# EAGLE design pihat (EAGLE 9.4.2)
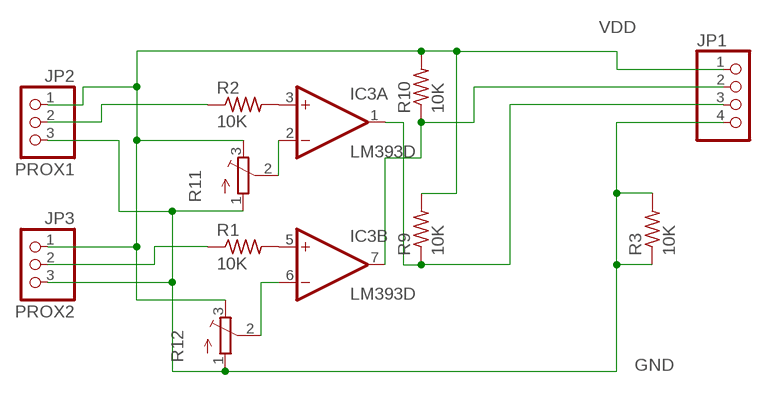
[diagram p0: schematic, sheet 1]

## Parts
IC3  LM393D  [SO08]
JP1  PINHD-1X4  [1X04]
JP2  PROX1  PINHD-1X3  [1X03]
JP3  PROX2  PINHD-1X3  [1X03]
R1  10K  RES-US1206FAB  [R1206FAB]
R2  10K  RES-US1206FAB  [R1206FAB]
R3  10K  RES-US1206FAB  [R1206FAB]
R9  10K  RES-US1206FAB  [R1206FAB]
R10  10K  RES-US1206FAB  [R1206FAB]
R11  TRIM_EU-3223G  [3223G]
R12  TRIM_EU-3223G  [3223G]

## Nets
GND: JP1.4 JP2.3 JP3.3 R3.1 R3.2 R11.1(A) R12.1(A)
N$1: IC3.5(B:+IN) R1.2
N$2: IC3.3(A:+IN) R2.2
N$8: JP2.2 R2.1
N$18: IC3.7(B:OUT) JP1.2 R10.1
N$19: IC3.1(A:OUT) JP1.3 R9.1
N$20: IC3.6(B:-IN) R12.2(S)
N$21: IC3.2(A:-IN) R11.2(S)
N$23: JP3.2 R1.1
VDD: JP1.1 JP2.1 JP3.1 R9.2 R10.2 R11.3(E) R12.3(E)

## Power pins joined to a net without a drawn wire
GND: IC3.4(P:V-)
VDD: IC3.8(P:V+)

## Library data of the parts
IC3 = linear:LM393: COMPARATOR
JP1 = pinhead:PINHD-1X4: PIN HEADER
JP2 JP3 = pinhead:PINHD-1X3: PIN HEADER
R1-R3 R9 R10 = fab:RES-US: Resistor (US Symbol) Variants with postfix FAB are widened to allow the routing of internal traces
R11 R12 = pot:TRIM_EU-: POTENTIOMETER

## Board
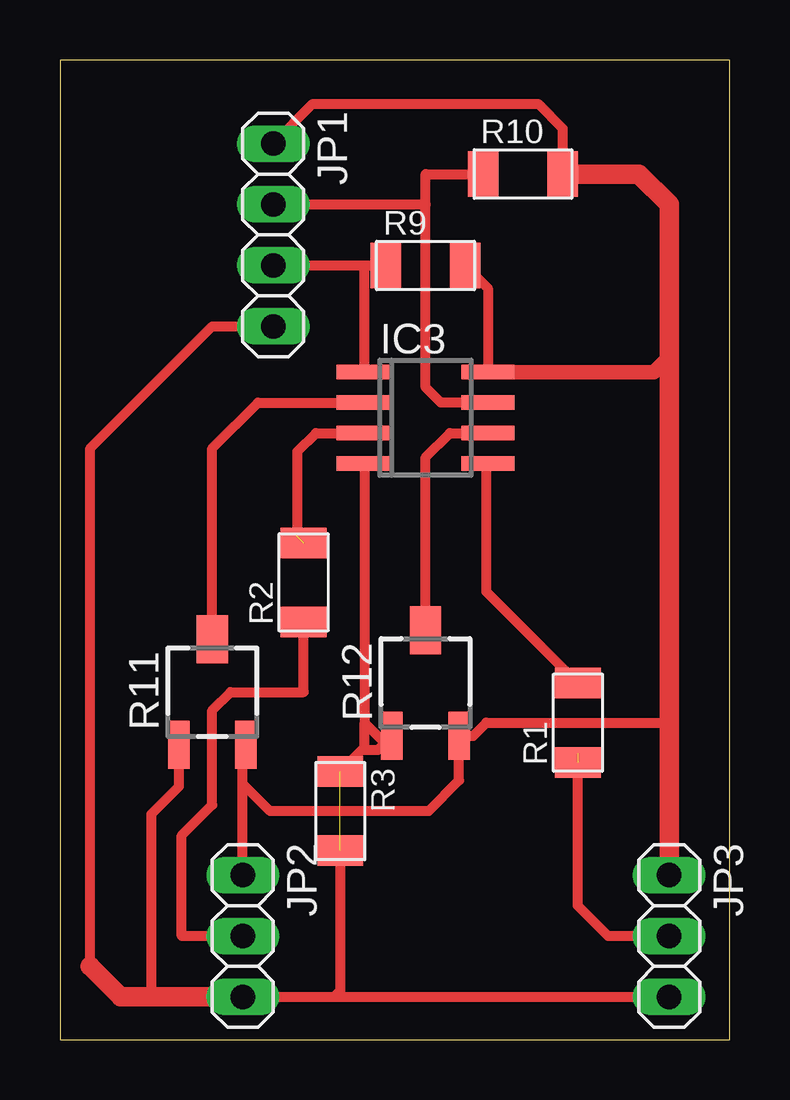
[diagram p1: board, top side]

Size 27.92 x 40.82 mm. Coordinates in mm from the lower left corner, seen from the top.
Outline: 0,0 27.92,0 27.92,40.82 0,40.82 0,0
Copper layers (1*16): Top 0.035mm / dielectric 1.5mm / Bottom 0.035mm
Design rules "default": minimum track width 6mil, minimum drill 0.35mm, track to track 6mil, track to pad 6mil, pad to pad 6mil, via to via 6mil, smd to smd 6mil, copper to edge 40mil, drill to drill 6mil, minimum pad ring 10mil, minimum via ring 8mil, stop-mask expansion 4mil, vias tented up to drill 0mil, thermal gap 10mil

### Footprints (pad centres in the part's own frame; a part is rotated, then mirrored left to right if it is on the bottom)
SO08 = smd 0.6 x 2.2: 1 -1.905,-2.6; 2 -0.635,-2.6; 3 0.635,-2.6; 4 1.905,-2.6; 5 1.905,2.6; 6 0.635,2.6; 7 -0.635,2.6; 8 -1.905,2.6
1X04 = drill 1.016 long: 1 -3.81,0; 2 -1.27,0; 3 1.27,0; 4 3.81,0
1X03 = drill 1.016 long: 1 -2.54,0; 2 0,0; 3 2.54,0
R1206FAB = smd 1.27 x 1.905: 1 -1.651,0; 2 1.651,0
3223G = smd 2 x 0.9: 1 -2.2,1.4; 3 -2.2,-1.4 | smd 2 x 1.3: 2 2.2,0

### Placement (x,y rotation side)
IC3  15.24,25.91 270 top
JP1  8.89,33.53 270 top
JP2  7.62,4.32 270 top
JP3  25.4,4.32 270 top
R1  21.59,13.21 90 top
R2  10.16,19.05 90 top
R3  11.68,9.53 270 top
R9  15.24,32.26 0 top
R10  19.3,36.07 0 top
R11  6.35,14.48 90 top
R12  15.24,14.86 90 top

### Tracks (layer width: path | path; a pad name or v marks a point on that pad's centre or on a via)
GND  (1 unrouted)
  Top 0.406: IC3.4 12.7,23.94 12.7,13.21 | 12.7,13.21 13.97,11.94 | 5.08,12.41 R11.1 4.95,10.54 3.81,9.4 3.81,1.78 | 1.27,3.05 1.27,24.64 6.35,29.72 JP1.4 | JP2.3 11.43,1.78 | 11.43,1.78 JP3.3 | R3.1 12.57,12.07 | 12.57,12.07 12.7,12.19 12.7,13.21 | R12.1 13.25,12.07 12.57,12.07 | R3.2 11.68,2.03 11.43,1.78
  Top 0.813: JP2.3 3.81,1.78 2.54,1.78 1.27,3.05
N$1
  Top 0.406: R1.2 17.78,18.67 17.78,23.94 IC3.5
N$2  (1 unrouted)
  Top 0.406: 9.78,21.08 R2.2 9.91,20.96 9.91,24.51 10.67,25.27 IC3.3
N$8
  Top 0.406: JP2.2 5.08,4.32 5.08,8.51 6.35,9.78 6.35,13.72 7.11,14.48 10.16,14.48 R2.1
N$18
  Top 0.406: 17.78,36.85 R10.1 15.24,36.07 15.24,34.8 | IC3.7 15.88,26.54 15.24,27.18 15.24,34.8 | JP1.2 15.24,34.8
N$19
  Top 0.406: 13.97,32.26 R9.1 12.7,32.26 | JP1.3 12.7,32.26 | IC3.1 12.7,27.87 12.7,32.26
N$20
  Top 0.406: R12.2 15.24,24.26 16.26,25.27 IC3.6
N$21
  Top 0.406: R11.2 6.35,24.64 8.26,26.54 IC3.2
N$23  (1 unrouted)
  Top 0.406: JP3.2 22.86,4.32 21.59,5.59 21.59,11.94
VDD
  Top 0.406: JP2.1 7.62,10.67 | 7.62,10.67 7.62,12.15 R11.3 | 7.62,10.67 8.76,9.53 15.37,9.53 16.64,10.8 R12.3 17.23,12.66 17.78,13.21 25.4,13.21 | JP1.1 10.54,38.99 19.94,38.99 20.95,37.97 R10.2 | R9.2 17.84,31.31 IC3.8
  Top 0.61: IC3.8 24.77,27.81 25.4,28.45
  Top 0.813: JP3.1 25.4,13.21 25.4,28.45 25.4,34.8 24.13,36.07 R10.2